# Altium schematic sheet INVERTER_12V_TO_220V_FROM_ATX_POWER_SUPPLY.SchDoc
size A4
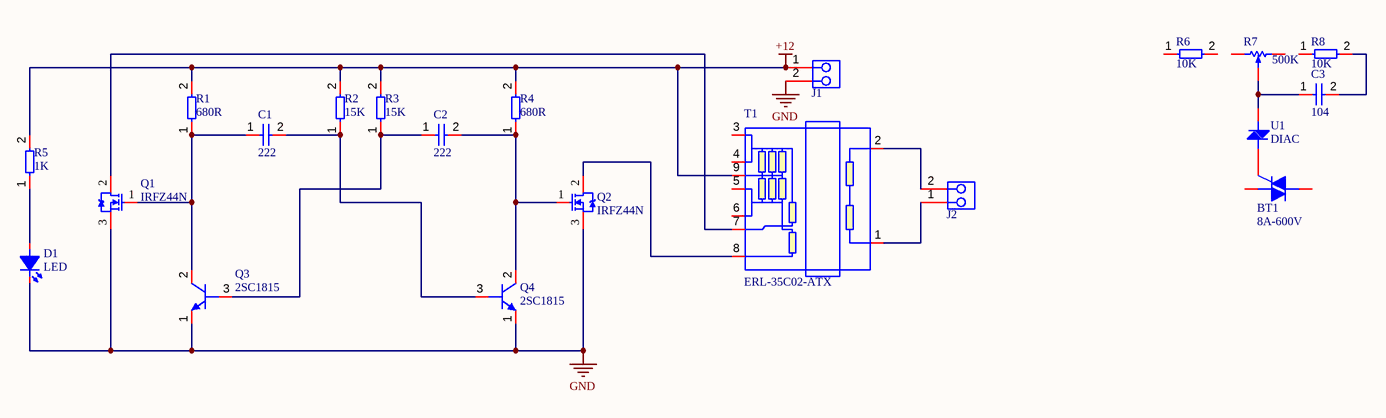
[diagram p0: INVERTER_12V_TO_220V_FROM_ATX_POWER_SUPPLY.SchDoc]

## Parts
BT1  8A-600V  [TO-220A]
C1  222  [CAP_Ceramic_Disc_3]
C2  222  [CAP_Ceramic_Disc_3]
C3  104  [CAP_Ceramic_Disc_2]
D1  LED  [LED_5MM]
J1  DEGSON  [DG127-5.0-02P-14-00AH]  (value not drawn)
J2  DEGSON  [DG127-5.0-02P-14-00AH]  (value not drawn)
Q1  IRFZ44N  [TO-220A]
Q2  IRFZ44N  [TO-220A]
Q3  2SC1815  [TO-92]
Q4  2SC1815  [TO-92]
R1  680R  [RES-0.25W-H-MF]
R2  15K  [RES-0.25W-H-MF]
R3  15K  [RES-0.25W-H-MF]
R4  680R  [RES-0.25W-H-MF]
R5  1K  [RES-0.25W-H-MF]
R6  10K  [RES-0.25W-H-MF]
R7  500K  [TrimmingPotentiometer]
R8  10K  [RES-0.25W-H-MF]
T1  ERL-35C02-ATX  [TRANSFORMER-ERL-35C02-ATX]
U1  DIAC  [SOT23-3]

## Nets
+12: J1.1 R1.2 R2.2 R3.2 R4.2 R5.2 T1.9
GND: D1.2(K) J1.2 Q1.3(S) Q2.3(S) Q3.1(E) Q4.1(E)
NetBT1_3: BT1.3(G) U1.2
NetC1_1: C1.1 Q1.1(G) Q3.2(C) R1.1
NetC1_2: C1.2 Q4.3(B) R2.1
NetC2_1: C2.1 Q3.3(B) R3.1
NetC2_2: C2.2 Q2.1(G) Q4.2(C) R4.1
NetC3_1: C3.1 R7.2(W) U1.1
NetC3_2: C3.2 R8.2
NetD1_1: D1.1(A) R5.1
NetJ2_1: J2.1 T1.1
NetJ2_2: J2.2 T1.2
NetQ1_2: Q1.2(D) T1.7
NetQ2_2: Q2.2(D) T1.8

Not connected (* = marked no-connect by the designer): BT1 1(T1) 2(T2); R6 1 2; R7 1(+) 3(-); R8 1; T1 3 4 5 6

## Library data of the parts
BT1 = BT137
C1-C3 = Capacitors(Disc)
D1 = LED 5MM
J1 J2 = DG127-5.0-02P-14-00AH
Q3 Q4 = 2SC1815 (TO-92)
R1-R6 R8 = Resistors THD
R7 = Res-Var: Bourns 3296 pot
T1 = TRANS-ERL-35C02-ATX
U1 = DIAC-DB3